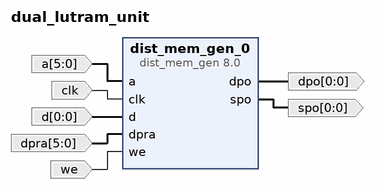
[diagram p0: block diagram of the top level]
# Vivado block design dual_lutram_unit, xc7z020clg484-1, Vivado 2024.2
create_bd_design dual_lutram_unit

create_bd_port -dir I -from 5 -to 0 a
create_bd_port -dir I -from 5 -to 0 dpra
create_bd_port -dir I clk
create_bd_port -dir O -from 0 -to 0 spo
create_bd_port -dir O -from 0 -to 0 dpo
create_bd_port -dir I we
create_bd_port -dir I -from 0 -to 0 d

create_bd_cell -type ip -vlnv xilinx.com:ip:dist_mem_gen:8.0 dist_mem_gen_0
set_property -dict {CONFIG.data_width 1 CONFIG.memory_type dual_port_ram} [get_bd_cells dist_mem_gen_0]

# ---- connections ----

connect_bd_net -net a_0_1 [get_bd_ports a] [get_bd_pins dist_mem_gen_0/a]
connect_bd_net -net clk_0_1 [get_bd_ports clk] [get_bd_pins dist_mem_gen_0/clk]
connect_bd_net -net d_0_1 [get_bd_ports d] [get_bd_pins dist_mem_gen_0/d]
connect_bd_net [get_bd_pins dist_mem_gen_0/dpo] [get_bd_ports dpo]
connect_bd_net [get_bd_pins dist_mem_gen_0/spo] [get_bd_ports spo]
connect_bd_net -net dpra_0_1 [get_bd_ports dpra] [get_bd_pins dist_mem_gen_0/dpra]
connect_bd_net -net we_0_1 [get_bd_ports we] [get_bd_pins dist_mem_gen_0/we]

validate_bd_design
save_bd_design
